# Altium schematic sheet 5V0BUCKFINAL.SchDoc
size A
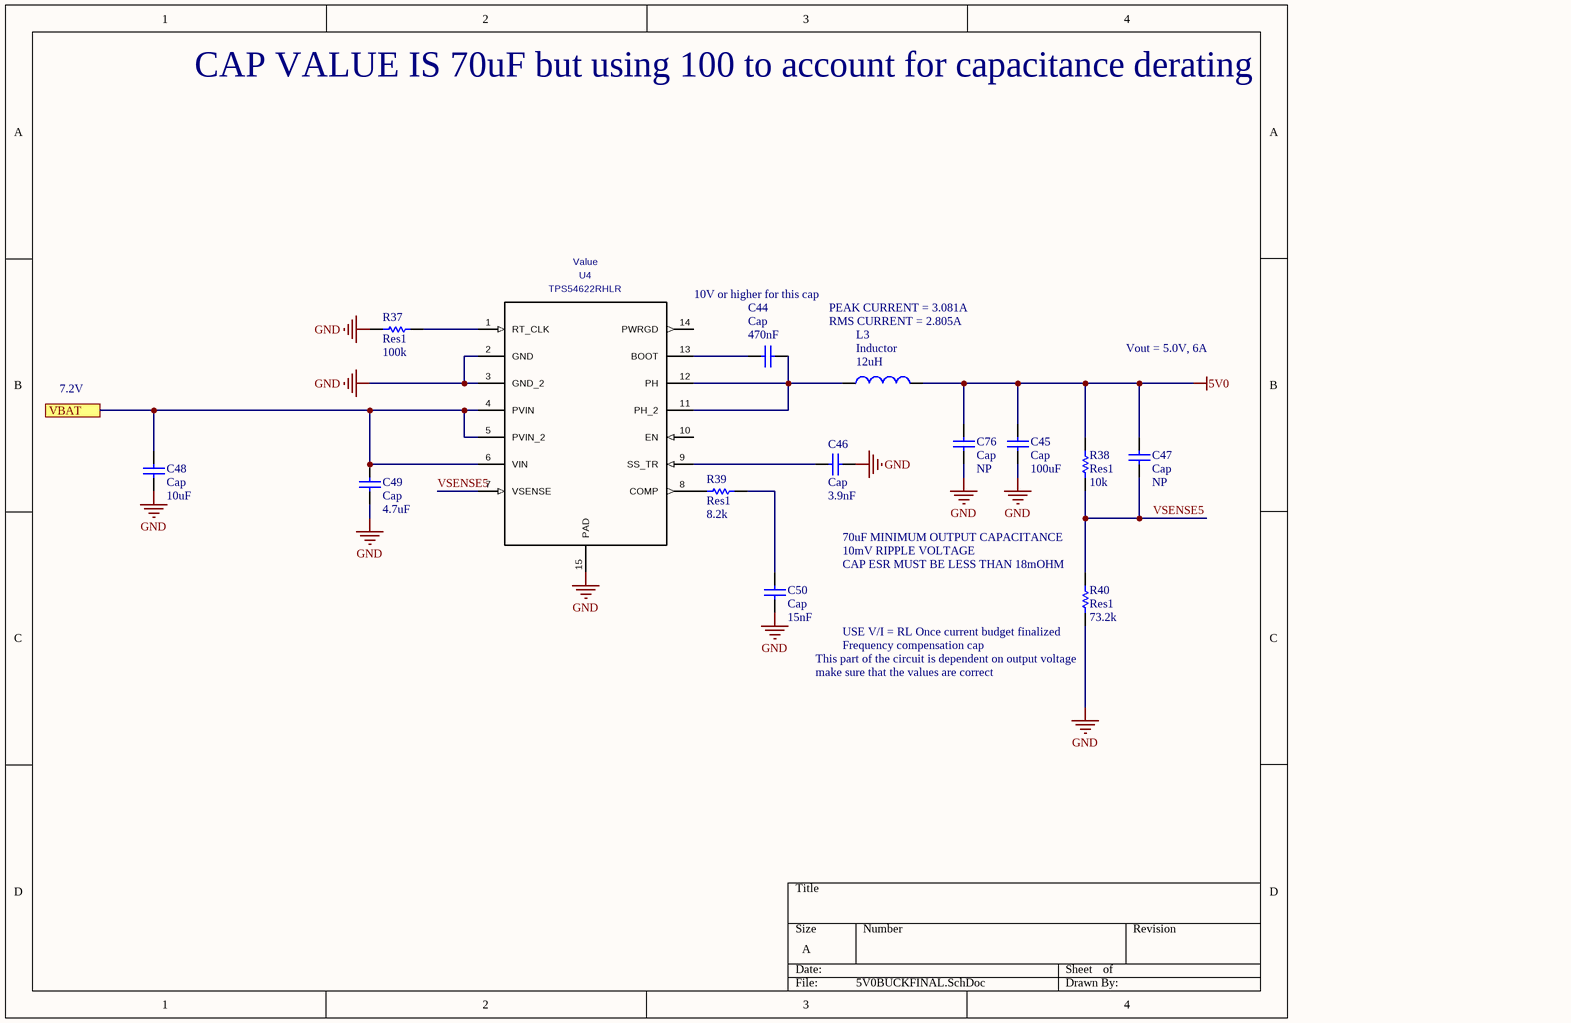
[diagram p0: 5V0BUCKFINAL.SchDoc]

## Parts
C44  Cap  value 470nF  [0402-A]
C45  Cap  value 100uF  [C1210]
C46  Cap  value 3.9nF  [0402-A]
C47  Cap  value NP  [1608[0603]]
C48  Cap  value 10uF  [6-0805_M]
C49  Cap  value 4.7uF  [6-0805_M]
C50  Cap  value 15nF  [0402-A]
C76  Cap  value NP  [1608[0603]]
L3  Inductor  value 12uH  [IND_BOURNS_SRR1260]
R37  Res1  value 100k  [0402-A]
R38  Res1  value 10k  [0402-A]
R39  Res1  value 8.2k  [0402-A]
R40  Res1  value 73.2k  [0402-A]
U4  TPS54622RHLR  [RHL0014A]

## Ports
VBAT

## Nets
5V0: C45.2 C47.2 C76.2 L3.2 R38.1
GND: C45.1 C46.1 C48.1 C49.1 C50.1 C76.1 R37.1 R40.1 U4.2(GND) U4.3(GND_2) U4.15(PAD)
VBAT: C48.2 C49.2 U4.4(PVIN) U4.5(PVIN_2) U4.6(VIN) ; port VBAT
VSENSE5: C47.1 R38.2 R40.2 U4.7(VSENSE)
NetC44_1: C44.1 U4.13(BOOT)
NetC44_2: C44.2 L3.1 U4.11(PH_2) U4.12(PH)
NetC46_2: C46.2 U4.9(SS_TR)
NetC50_2: C50.2 R39.1
NetR37_2: R37.2 U4.1(RT_CLK)
NetR39_2: R39.2 U4.8(COMP)

Not connected (* = marked no-connect by the designer): U4 10(EN) 14(PWRGD)

## Notes on the sheet
- CAP VALUE IS 70uF but using 100 to account for capacitance derating
- 10V or higher for this cap
- PEAK CURRENT = 3.081A
- RMS CURRENT = 2.805A
- Vout = 5.0V, 6A
- 7.2V
- 70uF MINIMUM OUTPUT CAPACITANCE
- 10mV RIPPLE VOLTAGE
- CAP ESR MUST BE LESS THAN 18mOHM
- (near R40) USE V/I = RL Once current budget finalized
- (near R40) This part of the circuit is dependent on output voltage
- make sure that the values are correct
- Frequency compensation cap

## Library data of the parts
C44-C50 C76 = Cap: Capacitor; Published: 8-Jun-2000; LatestRevisionDate: 17-Jul-2002; LatestRevisionNote: Re-released for DXP Platform.; PackageReference: RAD-0.3; Publisher: Altium Limited; PackageDescription: Radial Cap, Thru-Hole; 2 Leads; 0.3 in Pin Spacing
L3 = Inductor: Code_IEC: 1005; Published: 8-Jun-2000; LatestRevisionDate: 29-May-2009; LatestRevisionNote: IPC-7351 Footprint Added.; PackageReference: 0402-A; Publisher: Altium Limited; PackageDescription: Chip Inductor; Code_JEITA: 0402
R37-R39 = Res1: Resistor; Published: 8-Jun-2000; LatestRevisionDate: 17-Jul-2002; LatestRevisionNote: Re-released for DXP Platform.; PackageReference: AXIAL-0.3; Publisher: Altium Limited; PackageDescription: Axial Device, Thru-Hole; 2 Leads; 0.3 in Pin Spacing
R40 = Res1: Resistor 1%; Published: 8-Jun-2000; LatestRevisionDate: 17-Jul-2002; LatestRevisionNote: Re-released for DXP Platform.; PackageReference: AXIAL-0.3; Publisher: Altium Limited; PackageDescription: Axial Device, Thru-Hole; 2 Leads; 0.3 in Pin Spacing
U4 = TPS54622RHLR: Manufacturer: Texas Instruments; CompType: IC; PIN_COUNT: 15; PartNumber: TPS54622RHLR; PackageReference: RHL0014A; MountType: SMT; RoHS: Y; Value: Value